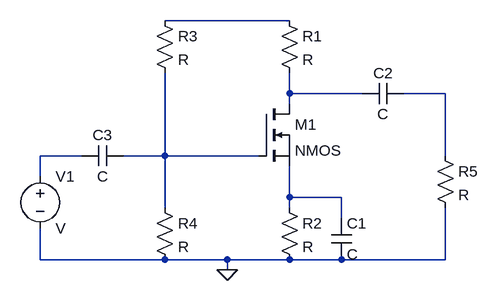
[diagram p0: schematic MOS_text1.asc]
MOS_text1.asc, the LTspice schematic file:
Version 4.1
SHEET 1 880 680
WIRE 208 -16 16 -16
WIRE 208 96 208 64
WIRE 320 96 208 96
WIRE 448 96 384 96
WIRE 208 112 208 96
WIRE -112 192 -176 192
WIRE 16 192 16 64
WIRE 16 192 -48 192
WIRE 160 192 16 192
WIRE 448 192 448 96
WIRE -176 224 -176 192
WIRE 208 256 208 208
WIRE 288 256 208 256
WIRE 16 272 16 192
WIRE 208 272 208 256
WIRE 288 288 288 256
WIRE -176 352 -176 304
WIRE 16 352 -176 352
WIRE 112 352 16 352
WIRE 208 352 112 352
WIRE 288 352 208 352
WIRE 448 352 448 272
WIRE 448 352 288 352
WIRE 112 368 112 352
FLAG 112 368 0
SYMBOL nmos 160 112 R0
SYMATTR InstName M1
SYMBOL res 192 -32 R0
SYMATTR InstName R1
SYMBOL res 192 256 R0
SYMATTR InstName R2
SYMBOL res 0 -32 R0
SYMATTR InstName R3
SYMBOL res 0 256 R0
SYMATTR InstName R4
SYMBOL cap 272 288 R0
SYMATTR InstName C1
SYMBOL cap 384 80 R90
WINDOW 0 0 32 VBottom 2
WINDOW 3 32 32 VTop 2
SYMATTR InstName C2
SYMBOL res 432 176 R0
SYMATTR InstName R5
SYMBOL voltage -176 208 R0
SYMATTR InstName V1
SYMBOL cap -112 176 M90
WINDOW 0 0 32 VBottom 2
WINDOW 3 32 32 VTop 2
SYMATTR InstName C3

The netlist it stands for:
* MOS_text1.asc
M1 N002 N005 N006 N006 NMOS
R1 N001 N002 R
R2 N006 0 R
R3 N001 N005 R
R4 N005 0 R
C1 N006 0 C
C2 N003 N002 C
R5 N003 0 R
V1 N004 0 V
C3 N004 N005 C
.model NMOS NMOS
.model PMOS PMOS
.lib standard.mos
.backanno
.end